# Altium schematic sheet KiemSoat.SchDoc
size A0
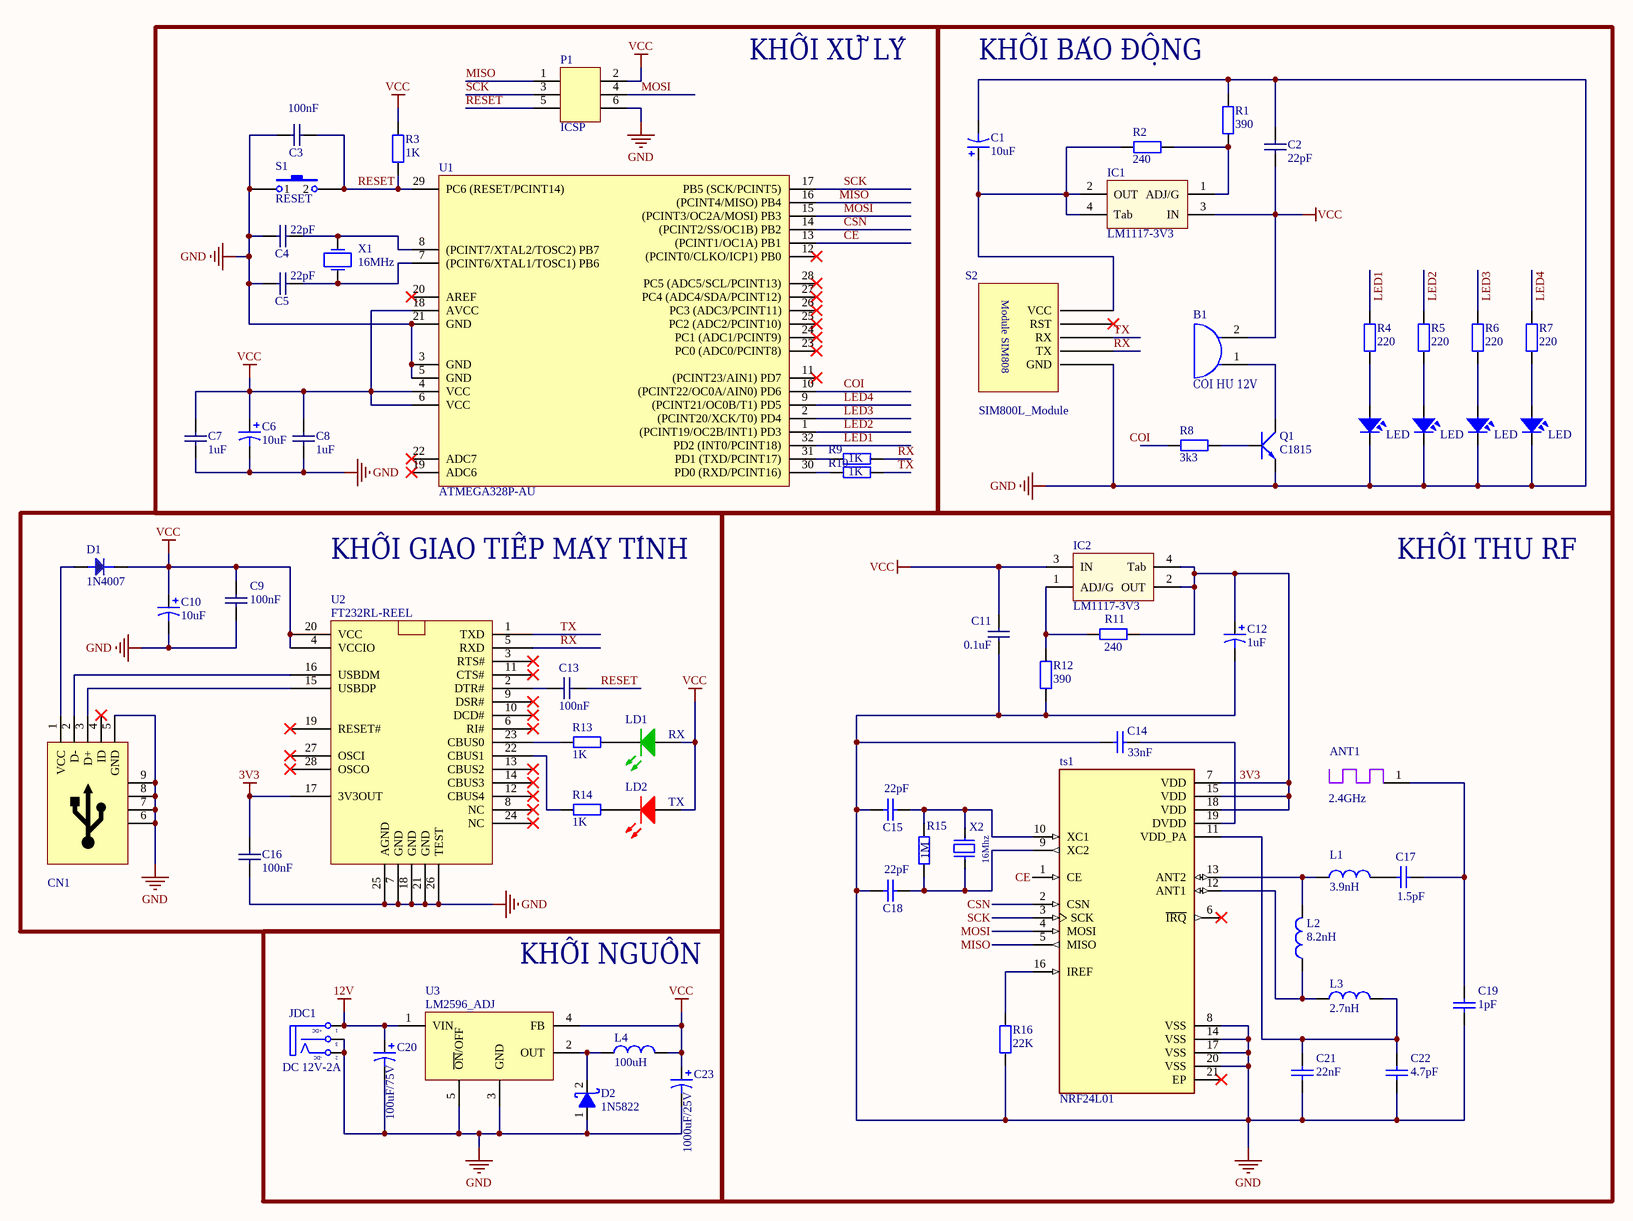
[diagram p0: KiemSoat.SchDoc]

## Parts
ANT1  2.4GHz  [PATCH ANTEN 2.45GHZ]
B1  CÒI HÚ 12V  [Buzzer]
C1  10uF  [CAP_0805]
C2  22pF  [CAPC0805]
C3  100nF  [CAPC0805]
C4  22pF  [CAPC0805]
C5  22pF  [CAPC0805]
C6  10uF  [CAP1206_TANTALUM_YELLOW]
C7  1uF  [CAP0603]
C8  1uF  [CAP0603]
C9  100nF  [CAP0603]
C10  10uF  [CAP1206_TANTALUM_YELLOW]
C11  0.1uF  [CAPC0805]
C12  1uF  [CAP_0805]
C13  100nF  [CAP0603]
C14  33nF  [CAPC0805]
C15  22pF  [CAPC0805]
C16  100nF  [CAP0603]
C17  1.5pF  [CAPC0805]
C18  22pF  [CAPC0805]
C19  1pF  [CAPC0805]
C20  100uF/75V  [CAP-ALU-SMD-G]
C21  22nF  [CAPC0805]
C22  4.7pF  [CAPC0805]
C23  1000uF/25V  [CAP-ALU-SMD-G]
CN1  690-005-299-043  [USB-B-MINI_690-005-299-043]  (value not drawn)
D1  1N4007  [DO-214AC]
D2  1N5822  [SM-DIODE]
IC1  LM1117-3V3  [SOT223-4N]
IC2  LM1117-3V3  [SOT223-4N]
JDC1  DC 12V-2A  [DC-IN]
L1  3.9nH  [INDC_DR127-1]
L2  8.2nH  [INDC_DR127-1]
L3  2.7nH  [INDC_DR127-1]
L4  100uH  [Inductor_SMD]
LD1  RX  [LED_SMD0603_GREEN]
LD2  TX  [LED_SMD0603_RED]
LED1  LED  [LED-RED-0805]
LED2  LED  [LED-RED-0805]
LED3  LED  [LED-RED-0805]
LED4  LED  [LED-RED-0805]
P1  ICSP  [HDR_M_2X3_2.54]
Q1  C1815  [SOT23B]
R1  390  [RES_SMD_0805]
R2  240  [RES_SMD_0805]
R3  1K  [RES_SMD_0805]
R4  220  [RES_SMD_0805]
R5  220  [RES_SMD_0805]
R6  220  [RES_SMD_0805]
R7  220  [RES_SMD_0805]
R8  3k3  [RES_SMD_0805]
R9  1K  [RES_SMD_0805]
R10  1K  [RES_SMD_0805]
R11  240  [RES_SMD_0805]
R12  390  [RES_SMD_0805]
R13  1K  [RES_SMD_0805]
R14  1K  [RES_SMD_0805]
R15  1M  [RES_SMD_0805]
R16  22K  [RES_SMD_0805]
S1  RESET  [SW_B3U-1000P]
S2  SIM800L_Module  [SIM808_Module]
ts1  NRF24L01  [QFN50P400X400X95-21N]
U1  ATMEGA328P-AU  [TQFP-32]
U2  FT232RL-REEL  [SSOP28]
U3  LM2596_ADJ  [TO263-5]
X1  16MHz  [XTAL_SMD_HC-49S]
X2  16Mhz  [XTAL_SMD_HC-49S]

## Blocks framed on the sheet
KHỐI XỬ LÝ: C3-C8 P1 R3 R9 R10 S1 U1 X1
KHỐI BÁO ĐỘNG: B1 C1 C2 IC1 LED1-LED4 Q1 R1 R2 R4-R8 S2
KHỐI GIAO TIẾP MÁY TÍNH: C9 C10 C13 C16 CN1 D1 LD1 LD2 R13 R14 U2
KHỐI THU RF: ANT1 C11 C12 C14 C15 C17-C19 C21 C22 IC2 L1-L3 R11 R12 R15 R16 ts1 X2
KHỐI NGUỒN: C20 C23 D2 JDC1 L4 U3

## Nets
3V3: C12.1 C16.1 IC2.2(OUT) IC2.4(Tab) R11.1 ts1.7(VDD) ts1.15(VDD) ts1.18(VDD) U2.17(3V3OUT)
12V: C20.1 JDC1.1(T) U3.1(VIN)
GND: C1.2 C2.1 C3.1 C4.1 C5.1 C6.2 C7.2 C8.2 C9.2 C10.2 C11.1 C12.2 C14.1 C15.1 C16.2 C18.1 C19.1 C20.2 C21.1 C22.1 C23.2 CN1.5(GND) CN1.6 CN1.7 CN1.8 CN1.9 D2.1(A) JDC1.2(TN) JDC1.3(S) LED1.2 LED2.2 LED3.2 LED4.2 P1.6 Q1.1(E) R1.1 R12.1 R16.1 S1.1 S2.5(GND) ts1.8(VSS) ts1.14(VSS) ts1.17(VSS) ts1.20(VSS) U1.3(GND) U1.5(GND) U1.21(GND) U2.7(GND) U2.18(GND) U2.21(GND) U2.25(AGND) U2.26(TEST) U3.3(GND) U3.5(~{ON}/OFF)
VCC: B1.2(B) C2.2 C6.1 C7.1 C8.1 C9.1 C10.1 C11.2 C23.1 D1.2(K) IC1.3(IN) IC2.3(IN) L4.2 LD1.1(A) LD2.1(A) P1.2 R3.2 U1.4(VCC) U1.6(VCC) U1.18(AVCC) U2.4(VCCIO) U2.20(VCC) U3.4(FB)
CE: ts1.1(CE) U1.13((PCINT1/OC1A)_PB1)
COI: R8.1 U1.10((PCINT22/OC0A/AIN0)_PD6)
CSN: ts1.2(CSN) U1.14((PCINT2/SS/OC1B)_PB2)
LED1: R4.1 U1.32(PD2_(INT0/PCINT18))
LED2: R5.1 U1.1((PCINT19/OC2B/INT1)_PD3)
LED3: R6.1 U1.2((PCINT20/XCK/T0)_PD4)
LED4: R7.1 U1.9((PCINT21/OC0B/T1)_PD5)
MISO: P1.1 ts1.5(MISO) U1.16((PCINT4/MISO)_PB4)
MOSI: P1.4 ts1.4(MOSI) U1.15((PCINT3/OC2A/MOSI)_PB3)
RESET: C3.2 C13.2 P1.5 R3.1 S1.2 U1.29(PC6_(RESET/PCINT14))
RX: R9.2 S2.4(TX) U2.5(RXD)
SCK: P1.3 ts1.3(SCK) U1.17(PB5_(SCK/PCINT5))
TX: R10.2 S2.3(RX) U2.1(TXD)
NetANT1_1: ANT1.1(ANT) C17.2 C19.2
NetB1_1: B1.1(A) Q1.2(C)
NetC1_1: C1.1 IC1.2(OUT) IC1.4(Tab) R2.1 S2.1(VCC)
NetC4_2: C4.2 U1.8((PCINT7/XTAL2/TOSC2)_PB7) X1.2(OSC2)
NetC5_2: C5.2 U1.7((PCINT6/XTAL1/TOSC1)_PB6) X1.1(OSC1)
NetC13_1: C13.1 U2.2(DTR#)
NetC14_2: C14.2 ts1.19(DVDD)
NetC15_2: C15.2 R15.2 ts1.10(XC1) X2.1
NetC17_1: C17.1 L1.2
NetC18_2: C18.2 R15.1 ts1.9(XC2) X2.2
NetC21_2: C21.2 C22.2 L3.2 ts1.11(VDD_PA)
NetCN1_1: CN1.1(VCC) D1.1(A)
NetCN1_2: CN1.2(D-) U2.16(USBDM)
NetCN1_3: CN1.3(D+) U2.15(USBDP)
NetD2_2: D2.2(K) L4.1 U3.2(OUT)
NetIC1_1: IC1.1(ADJ/G) R1.2 R2.2
NetIC2_1: IC2.1(ADJ/G) R11.2 R12.2
NetL1_1: L1.1 L2.2 ts1.13(ANT2)
NetL2_1: L2.1 L3.1 ts1.12(ANT1)
NetLD1_2: LD1.2(K) R13.2
NetLD2_2: LD2.2(K) R14.2
NetLED1_1: LED1.1 R4.2
NetLED2_1: LED2.1 R5.2
NetLED3_1: LED3.1 R6.2
NetLED4_1: LED4.1 R7.2
NetQ1_3: Q1.3(B) R8.2
NetR9_1: R9.1 U1.31(PD1_(TXD/PCINT17))
NetR10_1: R10.1 U1.30(PD0_(RXD/PCINT16))
NetR13_1: R13.1 U2.23(CBUS0)
NetR14_1: R14.1 U2.22(CBUS1)
NetR16_2: R16.2 ts1.16(IREF)

Not connected (* = marked no-connect by the designer): CN1 4(ID)*; S2 2(RST)*; ts1 6(~{IRQ})* 21(EP)*; U1 11((PCINT23/AIN1)_PD7)* 12((PCINT0/CLKO/ICP1)_PB0)* 19(ADC6)* 20(AREF)* 22(ADC7)* 23(PC0_(ADC0/PCINT8))* 24(PC1_(ADC1/PCINT9))* 25(PC2_(ADC2/PCINT10))* 26(PC3_(ADC3/PCINT11))* 27(PC4_(ADC4/SDA/PCINT12))* 28(PC5_(ADC5/SCL/PCINT13))*; U2 3(RTS#)* 6(RI#)* 8(NC)* 9(DSR#)* 10(DCD#)* 11(CTS#)* 12(CBUS4)* 13(CBUS2)* 14(CBUS3)* 19(RESET#)* 24(NC)* 27(OSCI)* 28(OSCO)*

## Notes on the sheet
- (in symbol DCIN) +DC; -DC
- (in symbol SIM800L_Module) Module SIM808

## Library data of the parts
ANT1 = PCB antenna 2.45GHZ: Value: 2.45GHz
B1 = BUZZER
C1 C12 C20 C23 = Cap Pol 5mm: Polarized Capacitor (Axial); Published: 8-Jun-2000; LatestRevisionDate: 17-Jul-2002; LatestRevisionNote: Re-released for DXP Platform.; PackageReference: POLAR0.8; Publisher: Altium Limited
C2-C5 C7-C9 C11 C13 C16 = capacitor_non_polar: capacitor non polar
C6 C10 = T491A106K016AT: CAP TANT 10UF 16V 10% 1206; Manufacturer 1: KEMET; Manufacturer Size Code: A; Category 1: Capacitors; Capacitance: 10µF; Type: Molded; ESR (Equivalent Series Resistance): 7 Ohm; Lifetime @ Temp.: 2000 Hrs @ 85°C; Supplier 1: Digi-Key; Supplier Part Number 1: 399-8269-1-ND; Manufacturer Part Number 1: T491A106K016AT; RoHS 1: RoHS Compliant; Description 1: CAP TANT 10UF 16V 10% 1206; Stock 1: 54083; Pricing 1: 1=0.45, 10=0.312, 100=0.1873, 500=0.14048, 1000=0.11862 (USD); Packaging: Cut Tape (CT); Part Status: Active; Operating Temperature: -55°C ~ 125°C; Mounting Type: Surface Mount; Package / Case: 1206 (3216 Metric); Size / Dimension: 0.126" L x 0.063" W (3.20mm x 1.60mm); Height - Seated (Max): 0.071" (1.80mm); Lead Spacing: -; Features: General Purpose; Failure Rate: -; ComponentLink1URL: http://www.kemet.com/Lists/ProductCatalog/Attachments/254/KEM_T2005_T491.pdf; ComponentLink1Description: http://www.kemet.com/Lists/ProductCatalog/Attachments/254/KEM_T2005_T491.pdf; Value: 10uF; Tolerance: ±10%; Voltage - Rated: 16V
C14 C15 C17 C18 C22 = CapCeramic: Capacitor; Published: 8-Jun-2000; LatestRevisionDate: 17-Jul-2002; LatestRevisionNote: Re-released for DXP Platform.; PackageReference: RAD-0.3; Publisher: Altium Limited
  C14: Value: 33nF
  C15 C18: Value: 22pF
  C17: Value: 1.5pF
  C22: Value: 4.7pF
C19 = CapCeramic: Capacitor; Value: 33p; Published: 8-Jun-2000; LatestRevisionDate: 17-Jul-2002; LatestRevisionNote: Re-released for DXP Platform.; PackageReference: RAD-0.3; Publisher: Altium Limited
C21 = CapCeramic: Capacitor; Value: 2.2nF; Published: 8-Jun-2000; LatestRevisionDate: 17-Jul-2002; LatestRevisionNote: Re-released for DXP Platform.; PackageReference: RAD-0.3; Publisher: Altium Limited
CN1 = USB_690-005-299-043: CONN MINI USB RCPT RA TYPE B SMD; Manufacturer: EDAC Inc.; Connector Type: USB - mini B; Number of Contacts: 5; Gender: Receptacle; Specifications: USB 2.0; Current Rating: 1A; Mating Cycles: 1500; Shielding: Unshielded; Material Flammability Rating: UL94 V-0; Supplier 1: Digi-Key; Manufacturer Part Number: 690-005-299-043; RoHS: RoHS Compliant; Category: Connectors, Interconnects; Stock 1: 72905; Pricing 1: 1=0.54, 10=0.51, 25=0.4592, 50=0.408, 100=0.391, 250=0.357, 500=0.34 (USD); Packaging: Cut Tape (CT); Part Status: Active; Mounting Type: Surface Mount, Right Angle; Mounting Feature: Horizontal; Termination: Solder; Features: Board Guide, Solder Retention; Ingress Protection: -; Operating Temperature: -30°C ~ 80°C; Voltage - Rated: -; Contact Finish: Gold; Shell/Shielding Material: Brass; Insulation Color: Black; ComponentLink1URL: http://files.edac.net/690-005-299-043.pdf; ComponentLink1Description: http://files.edac.net/690-005-299-043.pdf; Supplier Part Number 1: 151-1206-1-ND
D1 = diode
D2 = 1N5822: Schottky Rectifiers; Value: Diode c?m 1N5408
IC1 IC2 = LM1117_1: 3v3; Value: LM317
JDC1 = DCIN: Jac DC input; Value: Jac DC
L1-L3 = L1: Inductor; Value: 150 mH
L4 = Inductor: Value: 150 mH
LD1 = LED_LTST-C191KGKT: LED GREEN CLEAR 0603 SMD; Manufacturer 1: Lite-On Inc.; Category 1: Optoelectronics; Lens Color: Colorless; Millicandela Rating: 35mcd; Lens Style/Size: Rectangle with Flat Top, 1.10mm x 0.80mm; Voltage - Forward (Vf) (Typ): 2V; Current - Test: 20mA; Viewing Angle: 130°; Wavelength - Dominant: 571nm; Wavelength - Peak: 574nm; Supplier 1: Digi-Key; Supplier Part Number 1: 160-1446-1-ND; Manufacturer Part Number 1: LTST-C191KGKT; RoHS 1: RoHS Compliant; Description 1: LED GREEN CLEAR 0603 SMD; Stock 1: 1325167; Pricing 1: 1=0.29, 10=0.211, 25=0.1556, 100=0.1111, 250=0.07556, 500=0.06666, 1000=0.05222, 2500=0.05111 (USD); Packaging: Cut Tape (CT); Part Status: Active; Color: Green; Lens Transparency: Clear; Mounting Type: Surface Mount; Features: -; Size / Dimension: 1.60mm L x 0.80mm W; Height (Max): 0.55mm; ComponentLink1URL: http://optoelectronics.liteon.com/upload/download/DS22-2000-228/S_110_LTST-C191KGKT.pdf; ComponentLink1Description: http://optoelectronics.liteon.com/upload/download/DS22-2000-228/S_110_LTST-C191KGKT.pdf; Package / Case: 0603 (1608 Metric)
LD2 = LED_LTST-C191KRKT: LED RED CLEAR 0603 SMD; Manufacturer: Lite-On Inc.; Lens Color: Colorless; Millicandela Rating: 54mcd; Lens Style/Size: Rectangle with Flat Top, 1.10mm x 0.80mm; Voltage - Forward (Vf) (Typ): 2V; Current - Test: 20mA; Viewing Angle: 130°; Wavelength - Dominant: 631nm; Wavelength - Peak: 639nm; Supplier 1: Digi-Key; Manufacturer Part Number: LTST-C191KRKT; RoHS: RoHS Compliant; Category: Optoelectronics; Stock 1: 711347; Pricing 1: 1=0.29, 10=0.211, 25=0.1556, 100=0.1111, 250=0.07556, 500=0.06666, 1000=0.05222, 2500=0.05111 (USD); Packaging: Digi-Reel®; Part Status: Active; Color: Red; Lens Transparency: Clear; Mounting Type: Surface Mount; Features: -; Size / Dimension: 1.60mm L x 0.80mm W; Height (Max): 0.65mm; ComponentLink1URL: http://optoelectronics.liteon.com/upload/download/DS22-2000-223/LTST-C191KRKT.PDF; ComponentLink1Description: http://optoelectronics.liteon.com/upload/download/DS22-2000-223/LTST-C191KRKT.PDF; Supplier Part Number 1: 160-1447-6-ND; Package / Case: 0603 (1608 Metric)
LED1-LED4 = LED: LED Single colour Green and Red; Value: LED 3 ly Single Colour
P1 = header_2x3pins
Q1 = C1815: NPN 600mW, ECB; Value: C1815
R1-R16 = R1/4W: Resistor 1/4W; Value: R1/4W - 1K
S1 = SW-PB-2pin: Switch; Published: 24-Mar-1999; LatestRevisionDate: 17-Jul-2002; LatestRevisionNote: Re-released for DXP Platform.; PackageReference: SPST-2; Publisher: Altium Limited
ts1 = NRF24L01: IC RF TxRx Only General ISM > 1GHZ 2.4GHz 20-VFQFN Exposed Pad; MP: NRF24L01+; MF: Nordic Semiconductor; Availability: Unavailable; Package: QFN-20 Nordic Semiconductor; SnapEDA_Link: https://www.snapeda.com/parts/NRF24L01%2B/Nordic%20Semiconductor%20ASA/view-part/1023904/?ref=snap; Value: *; Price: None
U1 = atmega328p-au: AVR AVR® ATmega Microcontroller IC 8-Bit 20MHz 32KB (16K x 16) FLASH 32-TQFP (7x7)
U2 = FT232RL-REEL: USB Interface IC USB to Serial UART Enhanced IC SSOP-28; Manufacturer: FTDI; Data Rate: 12 Mb/s; Speed: Full Speed; Operating Supply Current: 25 mA; Operating Supply Voltage: 1.8 V to 5.25 V; Supplier 1: Mouser; Manufacturer Part Number: FT232RL-REEL; RoHS: RoHS Compliant; Category: USB Interface IC; Stock 1: 158762; Pricing 1: 1=4.50, 10=4.05, 50=3.85, 100=3.65, 250=3.25, 500=2.85, 1000=2.65, 2000=2.65 (USD); Package / Case: SSOP-28; Packaging: Cut Tape; Product: USB Bridge Controllers; Series: FT232; Type: Bridge, USB to UART; Brand: FTDI; Interface Type: UART; Mounting Style: SMD/SMT; Maximum Operating Temperature: + 85 C; Minimum Operating Temperature: - 40 C; Moisture Sensitive: Yes; Standard: USB 2.0; Standard Pack Qty: 2000; Tradename: R-CHIP; RoHS - Mouser: Y; Minimum Order Quantity: 1; Reeling: True; ComponentLink1URL: http://www.mouser.com/ds/2/163/DS_FT232R-11534.pdf; ComponentLink1Description: http://www.mouser.com/ds/2/163/DS_FT232R-11534.pdf; Supplier Part Number 1: 895-FT232RL
X1 = XTAL_9B-16.000MAAE-B: CRYSTAL 16.0000MHZ 12PF T/H; Manufacturer: TXC CORPORATION; Frequency Stability: ±30ppm; Operating Mode: Fundamental; Supplier 1: Digi-Key; Manufacturer Part Number: 9B-16.000MAAE-B; RoHS: RoHS Compliant; Category: Crystals, Oscillators, Resonators; Stock 1: 1060; Pricing 1: 1=0.33, 10=0.275, 50=0.2476, 100=0.22, 500=0.209, 1000=0.176, 2500=0.165, 5000=0.1595, 10000=0.154 (USD); Packaging: Bulk; Part Status: Active; Type: MHz Crystal; Frequency Tolerance: ±30ppm; Load Capacitance: 12pF; Operating Temperature: -20°C ~ 70°C; Ratings: -; Mounting Type: Through Hole; Package / Case: HC49/US; Size / Dimension: 0.453" L x 0.197" W (11.50mm x 5.00mm); Height - Seated (Max): 0.145" (3.68mm); ComponentLink1URL: http://www.txccorp.com/download/products/quartz_crystals/2015TXC_9B_33.pdf; ComponentLink1Description: http://www.txccorp.com/download/products/quartz_crystals/2015TXC_9B_33.pdf; Supplier Part Number 1: 887-2014-ND
X2 = XT2: Crystal For all Crystal 2pin.; Value: 4Mhz